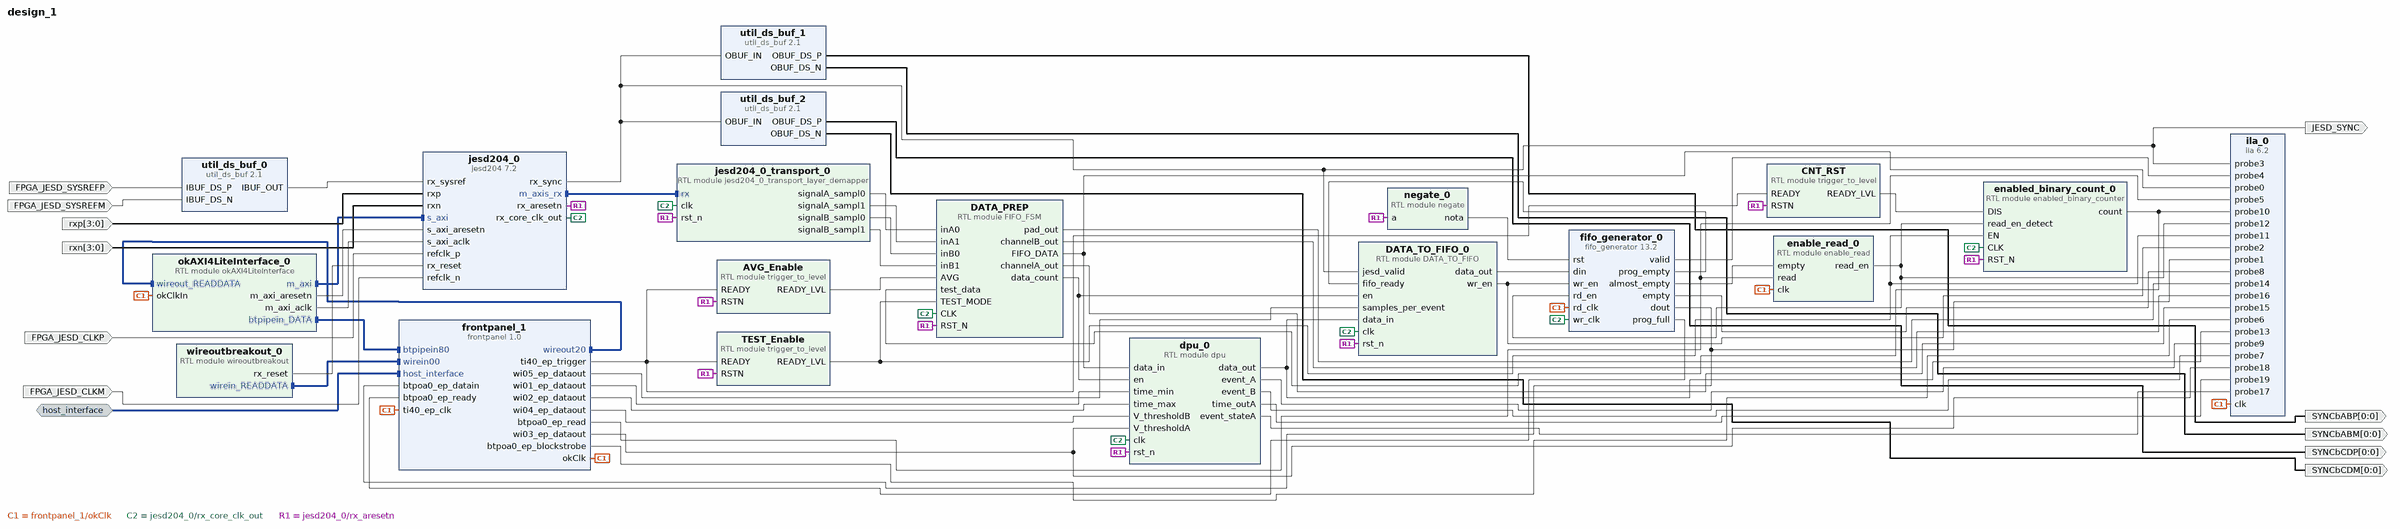
[diagram p0: block diagram of the top level]
# Vivado block design design_1, xc7k410tffg676-1, Vivado 2019.2
create_bd_design design_1

create_bd_intf_port -mode Slave -vlnv opalkelly.com:interface:host_interface_rtl:1.0 host_interface
create_bd_port -dir I -from 3 -to 0 rxp
create_bd_port -dir I -from 3 -to 0 rxn
create_bd_port -dir I FPGA_JESD_CLKP
create_bd_port -dir I FPGA_JESD_CLKM
create_bd_port -dir I FPGA_JESD_SYSREFP
create_bd_port -dir I FPGA_JESD_SYSREFM
create_bd_port -dir O JESD_SYNC
create_bd_port -dir O -from 0 -to 0 SYNCbABP
create_bd_port -dir O -from 0 -to 0 SYNCbABM
create_bd_port -dir O -from 0 -to 0 SYNCbCDP
create_bd_port -dir O -from 0 -to 0 SYNCbCDM

create_bd_cell -type ip -vlnv xilinx.com:ip:jesd204:7.2 jesd204_0
set_property -dict [list \
  CONFIG.AXICLK_FREQ 100.8 \
  CONFIG.C_DEFAULT_F 2 \
  CONFIG.C_DEFAULT_K 16 \
  CONFIG.C_LANES 4 \
  CONFIG.C_NODE_IS_TRANSMIT 0 \
  CONFIG.GT_Line_Rate 4.9152 \
  CONFIG.GT_REFCLK_FREQ 122.880 \
  CONFIG.Global_clk_sel false \
  CONFIG.SupportLevel 1 \
  CONFIG.TransceiverControl false \
] [get_bd_cells jesd204_0]
create_bd_cell -type ip -vlnv xilinx.com:ip:util_ds_buf:2.1 util_ds_buf_0
create_bd_cell -type ip -vlnv xilinx.com:ip:util_ds_buf:2.1 util_ds_buf_1
set_property -dict {CONFIG.C_BUF_TYPE OBUFDS} [get_bd_cells util_ds_buf_1]
create_bd_cell -type ip -vlnv xilinx.com:ip:util_ds_buf:2.1 util_ds_buf_2
set_property -dict {CONFIG.C_BUF_TYPE OBUFDS} [get_bd_cells util_ds_buf_2]
create_bd_cell -type ip -vlnv xilinx.com:ip:fifo_generator:13.2 fifo_generator_0
set_property -dict [list \
  CONFIG.Almost_Empty_Flag true \
  CONFIG.Almost_Full_Flag false \
  CONFIG.Empty_Threshold_Assert_Value 65530 \
  CONFIG.Enable_Safety_Circuit true \
  CONFIG.FIFO_Implementation_rach Common_Clock_Distributed_RAM \
  CONFIG.FIFO_Implementation_wach Common_Clock_Distributed_RAM \
  CONFIG.FIFO_Implementation_wrch Common_Clock_Distributed_RAM \
  CONFIG.Fifo_Implementation Independent_Clocks_Block_RAM \
  CONFIG.Full_Flags_Reset_Value 1 \
  CONFIG.Full_Threshold_Assert_Value 3912 \
  CONFIG.Full_Threshold_Negate_Value 32 \
  CONFIG.INTERFACE_TYPE Native \
  CONFIG.Input_Data_Width 32 \
  CONFIG.Input_Depth 65536 \
  CONFIG.Output_Data_Width 32 \
  CONFIG.Performance_Options First_Word_Fall_Through \
  CONFIG.Programmable_Empty_Type Single_Programmable_Empty_Threshold_Constant \
  CONFIG.Programmable_Full_Type Multiple_Programmable_Full_Threshold_Constants \
  CONFIG.Valid_Flag true \
] [get_bd_cells fifo_generator_0]
create_bd_cell -type ip -vlnv xilinx.com:ip:ila:6.2 ila_0
set_property -dict [list \
  CONFIG.C_ADV_TRIGGER false \
  CONFIG.C_DATA_DEPTH 4096 \
  CONFIG.C_ENABLE_ILA_AXI_MON false \
  CONFIG.C_MONITOR_TYPE Native \
  CONFIG.C_NUM_OF_PROBES 20 \
  CONFIG.C_PROBE10_WIDTH 32 \
  CONFIG.C_PROBE13_WIDTH 32 \
  CONFIG.C_PROBE14_WIDTH 32 \
  CONFIG.C_PROBE15_WIDTH 14 \
  CONFIG.C_PROBE16_WIDTH 14 \
  CONFIG.C_PROBE17_WIDTH 2 \
  CONFIG.C_PROBE18_WIDTH 32 \
  CONFIG.C_PROBE19_WIDTH 32 \
  CONFIG.C_PROBE2_WIDTH 1 \
] [get_bd_cells ila_0]
create_bd_cell -type module -reference okAXI4LiteInterface okAXI4LiteInterface_0
create_bd_cell -type module -reference wireoutbreakout wireoutbreakout_0
create_bd_cell -type module -reference jesd204_0_transport_layer_demapper jesd204_0_transport_0
create_bd_cell -type module -reference negate negate_0
create_bd_cell -type ip -vlnv opalkelly.com:ip:frontpanel:1.0 frontpanel_1
set_property -dict [list \
  CONFIG.BTPI.ADDR_0 0x80 \
  CONFIG.BTPI.COUNT 1 \
  CONFIG.BTPO.ADDR_0 0xa0 \
  CONFIG.BTPO.COUNT 1 \
  CONFIG.EXDES.FLOW {Block Designer} \
  CONFIG.EXDES.SELECTION PipeTest \
  CONFIG.PO.ADDR_0 0xff \
  CONFIG.PO.COUNT 0 \
  CONFIG.TI.ADDR_0 0x40 \
  CONFIG.TI.COUNT 1 \
  CONFIG.WI.ADDR_0 0x00 \
  CONFIG.WI.ADDR_1 0x01 \
  CONFIG.WI.ADDR_2 0x02 \
  CONFIG.WI.ADDR_3 0x03 \
  CONFIG.WI.ADDR_4 0x04 \
  CONFIG.WI.ADDR_5 0x05 \
  CONFIG.WI.COUNT 6 \
  CONFIG.WO.ADDR_0 0x20 \
  CONFIG.WO.COUNT 1 \
] [get_bd_cells frontpanel_1]
create_bd_cell -type module -reference enabled_binary_counter enabled_binary_count_0
set_property -dict {CONFIG.max_value 0x00000011} [get_bd_cells enabled_binary_count_0]
create_bd_cell -type module -reference enable_read enable_read_0
create_bd_cell -type module -reference trigger_to_level TEST_Enable
create_bd_cell -type module -reference trigger_to_level CNT_RST
set_property -dict {CONFIG.OFF 1 CONFIG.ON 2} [get_bd_cells CNT_RST]
create_bd_cell -type module -reference trigger_to_level AVG_Enable
set_property -dict {CONFIG.OFF 4 CONFIG.ON 5} [get_bd_cells AVG_Enable]
create_bd_cell -type module -reference FIFO_FSM DATA_PREP
create_bd_cell -type module -reference DATA_TO_FIFO DATA_TO_FIFO_0
create_bd_cell -type module -reference dpu dpu_0

# ---- connections ----

connect_bd_intf_net [get_bd_intf_pins okAXI4LiteInterface_0/m_axi] [get_bd_intf_pins jesd204_0/s_axi]
connect_bd_intf_net [get_bd_intf_pins okAXI4LiteInterface_0/btpipein_DATA] [get_bd_intf_pins frontpanel_1/btpipein80]
connect_bd_intf_net [get_bd_intf_pins wireoutbreakout_0/wirein_READDATA] [get_bd_intf_pins frontpanel_1/wirein00]
connect_bd_intf_net [get_bd_intf_pins jesd204_0_transport_0/rx] [get_bd_intf_pins jesd204_0/m_axis_rx]
connect_bd_intf_net [get_bd_intf_pins okAXI4LiteInterface_0/wireout_READDATA] [get_bd_intf_pins frontpanel_1/wireout20]
connect_bd_intf_net [get_bd_intf_ports host_interface] [get_bd_intf_pins frontpanel_1/host_interface]
connect_bd_net -net frontpanel_0_okClk [get_bd_pins frontpanel_1/okClk] \
  [get_bd_pins fifo_generator_0/rd_clk] [get_bd_pins ila_0/clk] [get_bd_pins okAXI4LiteInterface_0/okClkIn] \
  [get_bd_pins frontpanel_1/ti40_ep_clk] [get_bd_pins enable_read_0/clk]
connect_bd_net [get_bd_pins okAXI4LiteInterface_0/m_axi_aresetn] [get_bd_pins jesd204_0/s_axi_aresetn]
connect_bd_net [get_bd_pins okAXI4LiteInterface_0/m_axi_aclk] [get_bd_pins jesd204_0/s_axi_aclk]
connect_bd_net [get_bd_ports rxp] [get_bd_pins jesd204_0/rxp]
connect_bd_net [get_bd_ports rxn] [get_bd_pins jesd204_0/rxn]
connect_bd_net [get_bd_ports FPGA_JESD_CLKP] [get_bd_pins jesd204_0/refclk_p]
connect_bd_net [get_bd_ports FPGA_JESD_CLKM] [get_bd_pins jesd204_0/refclk_n]
connect_bd_net [get_bd_pins util_ds_buf_0/IBUF_OUT] [get_bd_pins jesd204_0/rx_sysref]
connect_bd_net [get_bd_ports FPGA_JESD_SYSREFP] [get_bd_pins util_ds_buf_0/IBUF_DS_P]
connect_bd_net [get_bd_ports FPGA_JESD_SYSREFM] [get_bd_pins util_ds_buf_0/IBUF_DS_N]
connect_bd_net [get_bd_pins jesd204_0/rx_sync] \
  [get_bd_ports JESD_SYNC] [get_bd_pins util_ds_buf_1/OBUF_IN] [get_bd_pins util_ds_buf_2/OBUF_IN] [get_bd_pins ila_0/probe3] \
  [get_bd_pins DATA_TO_FIFO_0/jesd_valid]
connect_bd_net [get_bd_pins jesd204_0/rx_core_clk_out] \
  [get_bd_pins jesd204_0_transport_0/clk] [get_bd_pins fifo_generator_0/wr_clk] [get_bd_pins enabled_binary_count_0/CLK] \
  [get_bd_pins DATA_PREP/CLK] [get_bd_pins DATA_TO_FIFO_0/clk] [get_bd_pins dpu_0/clk]
connect_bd_net [get_bd_pins wireoutbreakout_0/rx_reset] [get_bd_pins jesd204_0/rx_reset]
connect_bd_net [get_bd_pins util_ds_buf_1/OBUF_DS_P] [get_bd_ports SYNCbABP]
connect_bd_net [get_bd_pins util_ds_buf_1/OBUF_DS_N] [get_bd_ports SYNCbABM]
connect_bd_net [get_bd_pins util_ds_buf_2/OBUF_DS_P] [get_bd_ports SYNCbCDP]
connect_bd_net [get_bd_pins util_ds_buf_2/OBUF_DS_N] [get_bd_ports SYNCbCDM]
connect_bd_net [get_bd_pins jesd204_0/rx_aresetn] \
  [get_bd_pins jesd204_0_transport_0/rst_n] [get_bd_pins negate_0/a] [get_bd_pins enabled_binary_count_0/RST_N] \
  [get_bd_pins TEST_Enable/RSTN] [get_bd_pins CNT_RST/RSTN] [get_bd_pins AVG_Enable/RSTN] [get_bd_pins DATA_PREP/RST_N] \
  [get_bd_pins DATA_TO_FIFO_0/rst_n] [get_bd_pins dpu_0/rst_n]
connect_bd_net [get_bd_pins negate_0/nota] [get_bd_pins fifo_generator_0/rst]
connect_bd_net [get_bd_pins fifo_generator_0/valid] [get_bd_pins ila_0/probe4]
connect_bd_net [get_bd_pins frontpanel_1/btpoa0_ep_read] [get_bd_pins ila_0/probe5] [get_bd_pins enable_read_0/read]
connect_bd_net -net enabled_binary_count_0_OUT [get_bd_pins DATA_PREP/FIFO_DATA] [get_bd_pins ila_0/probe0] [get_bd_pins dpu_0/data_in]
connect_bd_net -net enable_write_0_wr_en [get_bd_pins DATA_TO_FIFO_0/wr_en] [get_bd_pins fifo_generator_0/wr_en] [get_bd_pins ila_0/probe2]
connect_bd_net [get_bd_pins frontpanel_1/btpoa0_ep_blockstrobe] [get_bd_pins ila_0/probe6]
connect_bd_net [get_bd_pins fifo_generator_0/dout] [get_bd_pins ila_0/probe1] [get_bd_pins frontpanel_1/btpoa0_ep_datain]
connect_bd_net [get_bd_pins fifo_generator_0/empty] [get_bd_pins ila_0/probe8]
connect_bd_net [get_bd_pins fifo_generator_0/prog_empty] [get_bd_pins DATA_TO_FIFO_0/fifo_ready]
connect_bd_net [get_bd_pins jesd204_0_transport_0/signalA_sampl0] [get_bd_pins DATA_PREP/inA0]
connect_bd_net [get_bd_pins jesd204_0_transport_0/signalA_sampl1] [get_bd_pins DATA_PREP/inA1]
connect_bd_net [get_bd_pins jesd204_0_transport_0/signalB_sampl0] [get_bd_pins DATA_PREP/inB0]
connect_bd_net [get_bd_pins jesd204_0_transport_0/signalB_sampl1] [get_bd_pins DATA_PREP/inB1]
connect_bd_net [get_bd_pins frontpanel_1/ti40_ep_trigger] [get_bd_pins TEST_Enable/READY] [get_bd_pins CNT_RST/READY] [get_bd_pins AVG_Enable/READY]
connect_bd_net -net trigger_to_level_0_READY_LVL [get_bd_pins TEST_Enable/READY_LVL] \
  [get_bd_pins ila_0/probe11] [get_bd_pins enabled_binary_count_0/EN] [get_bd_pins DATA_PREP/TEST_MODE]
connect_bd_net [get_bd_pins enabled_binary_count_0/count] [get_bd_pins ila_0/probe10] [get_bd_pins DATA_PREP/test_data]
connect_bd_net [get_bd_pins fifo_generator_0/prog_full] [get_bd_pins frontpanel_1/btpoa0_ep_ready]
connect_bd_net [get_bd_pins enable_read_0/read_en] \
  [get_bd_pins fifo_generator_0/rd_en] [get_bd_pins ila_0/probe12] [get_bd_pins enabled_binary_count_0/read_en_detect]
connect_bd_net [get_bd_pins fifo_generator_0/almost_empty] [get_bd_pins enable_read_0/empty]
connect_bd_net -net trigger_to_level_0_counter_reset [get_bd_pins CNT_RST/READY_LVL] [get_bd_pins enabled_binary_count_0/DIS]
connect_bd_net -net FIFO_FSM_0_pad_out [get_bd_pins DATA_PREP/pad_out] [get_bd_pins ila_0/probe14]
connect_bd_net -net trigger_to_level_2_READY_LVL [get_bd_pins AVG_Enable/READY_LVL] [get_bd_pins DATA_PREP/AVG]
connect_bd_net -net FIFO_FSM_0_channelB_out [get_bd_pins DATA_PREP/channelB_out] [get_bd_pins ila_0/probe16]
connect_bd_net -net FIFO_FSM_0_channelA_out [get_bd_pins DATA_PREP/channelA_out] [get_bd_pins ila_0/probe15]
connect_bd_net -net FIFO_FSM_0_data_count [get_bd_pins DATA_PREP/data_count] [get_bd_pins DATA_TO_FIFO_0/en] [get_bd_pins dpu_0/en]
connect_bd_net [get_bd_pins dpu_0/data_out] [get_bd_pins ila_0/probe13] [get_bd_pins DATA_TO_FIFO_0/data_in]
connect_bd_net [get_bd_pins frontpanel_1/wi01_ep_dataout] [get_bd_pins dpu_0/time_min]
connect_bd_net [get_bd_pins frontpanel_1/wi02_ep_dataout] [get_bd_pins dpu_0/time_max]
connect_bd_net [get_bd_pins dpu_0/event_A] [get_bd_pins ila_0/probe9]
connect_bd_net [get_bd_pins dpu_0/event_B] [get_bd_pins ila_0/probe7]
connect_bd_net [get_bd_pins frontpanel_1/wi03_ep_dataout] [get_bd_pins dpu_0/V_thresholdA] [get_bd_pins ila_0/probe18]
connect_bd_net [get_bd_pins frontpanel_1/wi04_ep_dataout] [get_bd_pins dpu_0/V_thresholdB]
connect_bd_net [get_bd_pins DATA_TO_FIFO_0/data_out] [get_bd_pins fifo_generator_0/din]
connect_bd_net -net dpu_0_time_out [get_bd_pins dpu_0/time_outA] [get_bd_pins ila_0/probe19]
connect_bd_net [get_bd_pins frontpanel_1/wi05_ep_dataout] [get_bd_pins DATA_TO_FIFO_0/samples_per_event]
connect_bd_net [get_bd_pins dpu_0/event_stateA] [get_bd_pins ila_0/probe17]

# ---- address map ----
assign_bd_address -offset 0x000 -range 4K -target_address_space [get_bd_addr_spaces okAXI4LiteInterface_0/m_axi] [get_bd_addr_segs jesd204_0/s_axi/Reg]

validate_bd_design
save_bd_design
